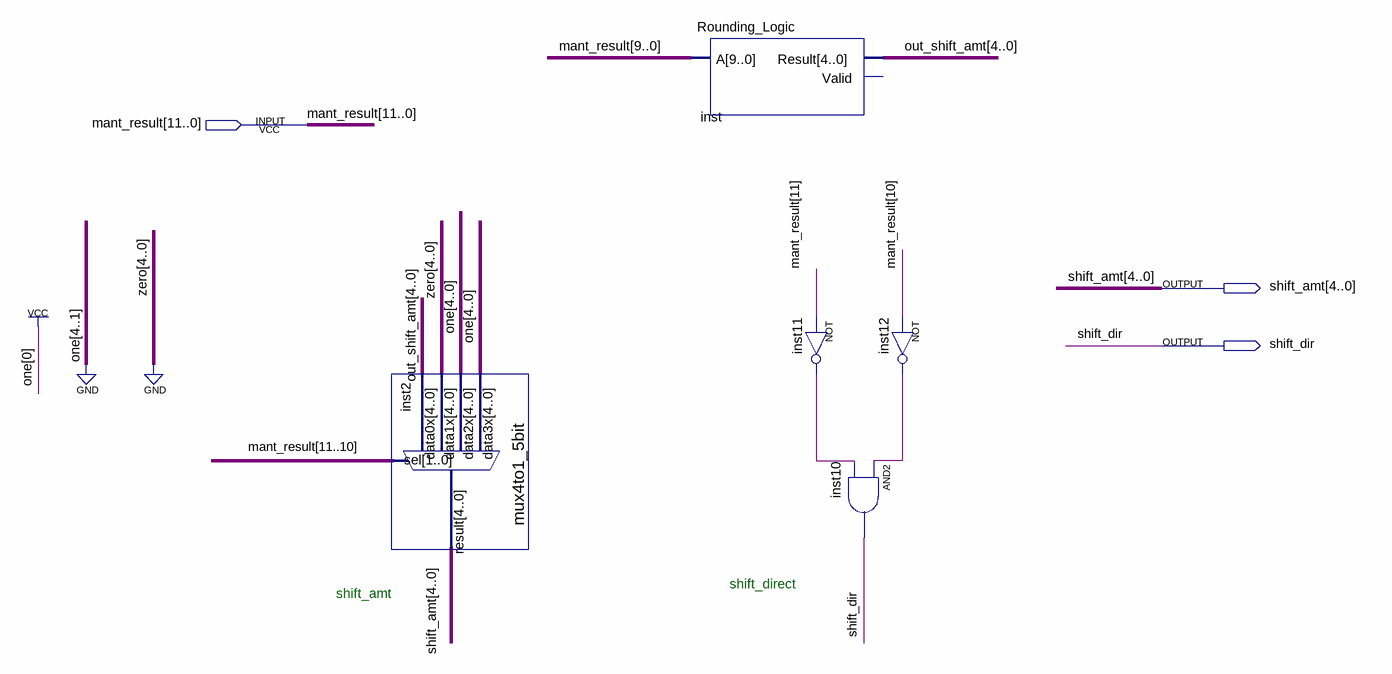
[diagram p0: schematic sheet]
// Quartus schematic test.bdf as structural Verilog: 5 symbols, 3 pins
module test (
  input  [11:0] mant_result,
  output [4:0] shift_amt,
  output shift_dir
);

  wire inst11_out, inst12_out;
  wire [4:0] out_shift_amt;

  mux4to1_5bit inst2 (
    .data3x(5'b00001), .data2x(5'b00001), .data1x({5{1'b0}}), .data0x(out_shift_amt),
    .sel(mant_result[11:10]), .result(shift_amt));
  Rounding_Logic inst (.A(mant_result[9:0]), .Result(out_shift_amt));  // open: Valid
  not inst11 (inst11_out, mant_result[11]);
  and inst10 (shift_dir, inst12_out, inst11_out);
  not inst12 (inst12_out, mant_result[10]);

  // Notes on the sheet:
  //   shift_direct
  //   shift_amt
endmodule
